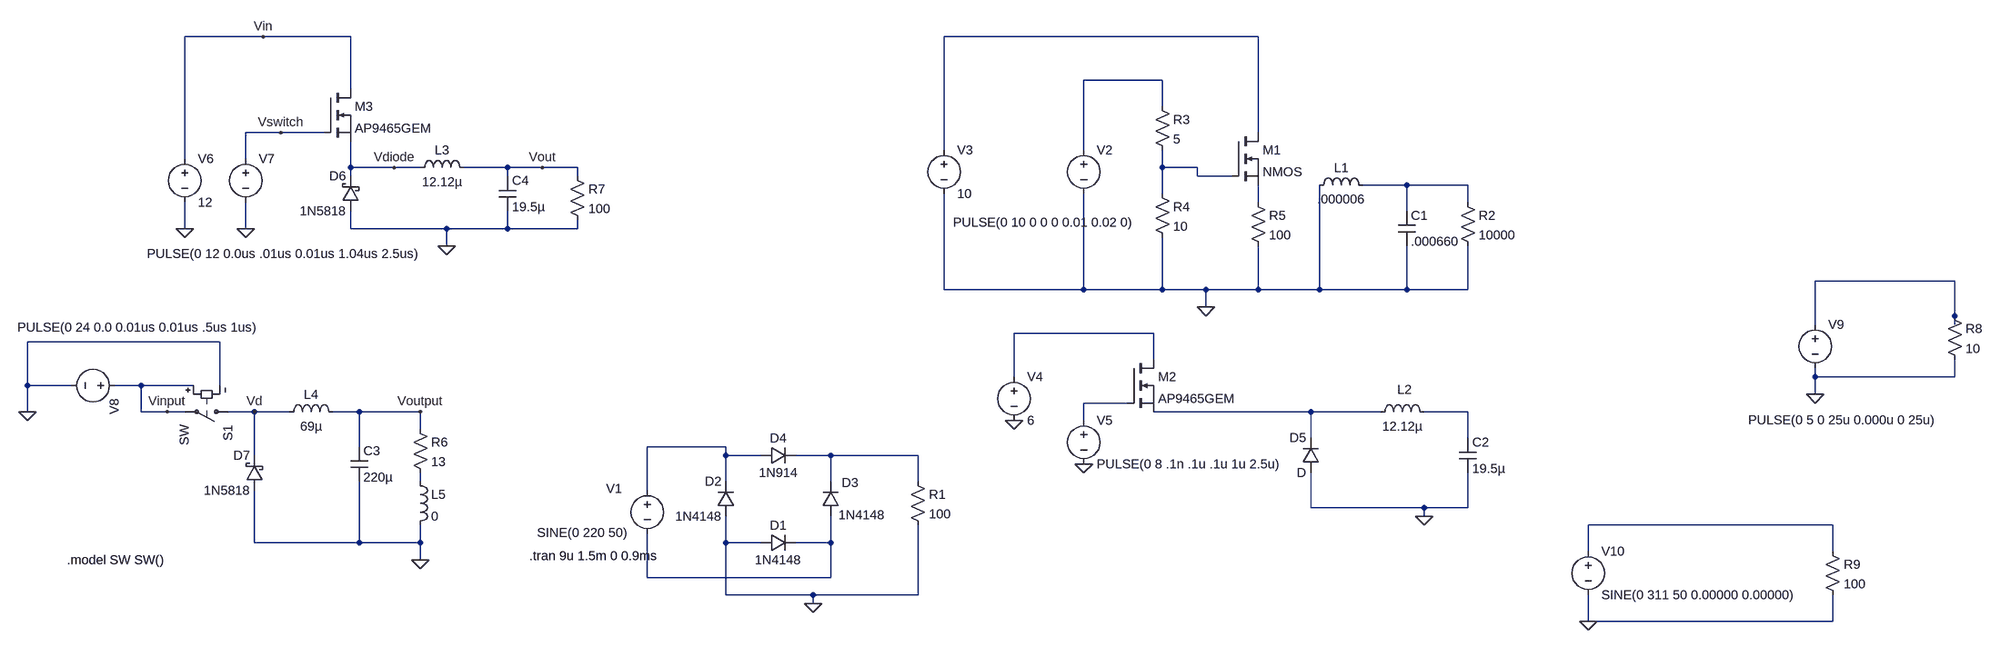
[diagram p0: schematic circuit_ver3.1.asc]
circuit_ver3.1.asc, the LTspice schematic file:
Version 4
SHEET 1 1276 680
WIRE -1952 -720 -2096 -720
WIRE -1792 -720 -1952 -720
WIRE -128 -720 -704 -720
WIRE -304 -640 -448 -640
WIRE -1792 -624 -1792 -720
WIRE -304 -592 -304 -640
WIRE -1920 -544 -1984 -544
WIRE -1840 -544 -1920 -544
WIRE -128 -544 -128 -720
WIRE -704 -512 -704 -720
WIRE -448 -512 -448 -640
WIRE -2096 -496 -2096 -720
WIRE -1984 -496 -1984 -544
WIRE -1792 -480 -1792 -528
WIRE -1712 -480 -1792 -480
WIRE -1664 -480 -1712 -480
WIRE -1504 -480 -1584 -480
WIRE -1440 -480 -1504 -480
WIRE -1376 -480 -1440 -480
WIRE -304 -480 -304 -512
WIRE -240 -480 -304 -480
WIRE -1792 -464 -1792 -480
WIRE -1504 -464 -1504 -480
WIRE -1376 -464 -1376 -480
WIRE -240 -464 -240 -480
WIRE -176 -464 -240 -464
WIRE 144 -448 64 -448
WIRE 256 -448 144 -448
WIRE -304 -432 -304 -480
WIRE -128 -416 -128 -448
WIRE 256 -416 256 -448
WIRE 144 -400 144 -448
WIRE -2096 -368 -2096 -416
WIRE -1984 -368 -1984 -416
WIRE -1792 -368 -1792 -400
WIRE -1616 -368 -1792 -368
WIRE -1504 -368 -1504 -400
WIRE -1504 -368 -1616 -368
WIRE -1376 -368 -1376 -384
WIRE -1376 -368 -1504 -368
WIRE -1616 -336 -1616 -368
WIRE 1152 -272 896 -272
WIRE -704 -256 -704 -432
WIRE -448 -256 -448 -432
WIRE -448 -256 -704 -256
WIRE -304 -256 -304 -352
WIRE -304 -256 -448 -256
WIRE -224 -256 -304 -256
WIRE -128 -256 -128 -336
WIRE -128 -256 -224 -256
WIRE -16 -256 -16 -448
WIRE -16 -256 -128 -256
WIRE 144 -256 144 -336
WIRE 144 -256 -16 -256
WIRE 256 -256 256 -336
WIRE 256 -256 144 -256
WIRE -224 -224 -224 -256
WIRE 1152 -208 1152 -272
WIRE 896 -192 896 -272
WIRE 1152 -192 1152 -208
WIRE -320 -176 -576 -176
WIRE -2032 -160 -2384 -160
WIRE -320 -128 -320 -176
WIRE -576 -96 -576 -176
WIRE 896 -96 896 -112
WIRE 1152 -96 1152 -128
WIRE 1152 -96 896 -96
WIRE -2384 -80 -2384 -160
WIRE -2304 -80 -2384 -80
WIRE -2176 -80 -2224 -80
WIRE -2080 -80 -2176 -80
WIRE -2032 -80 -2032 -160
WIRE 896 -64 896 -96
WIRE -368 -48 -448 -48
WIRE -2384 -32 -2384 -80
WIRE -2176 -32 -2176 -80
WIRE -2128 -32 -2176 -32
WIRE -2096 -32 -2128 -32
WIRE -1968 -32 -2016 -32
WIRE -1904 -32 -1968 -32
WIRE -1776 -32 -1824 -32
WIRE -1664 -32 -1776 -32
WIRE -32 -32 -320 -32
WIRE 96 -32 -32 -32
WIRE 256 -32 176 -32
WIRE -448 -16 -448 -48
WIRE -1664 0 -1664 -32
WIRE -32 16 -32 -32
WIRE 256 16 256 -32
WIRE -1776 32 -1776 -32
WIRE -1104 32 -1248 32
WIRE -1968 48 -1968 -32
WIRE -1104 48 -1104 32
WIRE -1040 48 -1104 48
WIRE -912 48 -976 48
WIRE -752 48 -912 48
WIRE -1664 96 -1664 80
WIRE -1104 96 -1104 48
WIRE -912 96 -912 48
WIRE -752 96 -752 48
WIRE -1248 112 -1248 32
WIRE -32 144 -32 80
WIRE 176 144 -32 144
WIRE 256 144 256 80
WIRE 256 144 176 144
WIRE 176 160 176 144
WIRE 928 176 480 176
WIRE -1968 208 -1968 112
WIRE -1776 208 -1776 96
WIRE -1776 208 -1968 208
WIRE -1664 208 -1664 176
WIRE -1664 208 -1776 208
WIRE -1104 208 -1104 160
WIRE -1040 208 -1104 208
WIRE -912 208 -912 160
WIRE -912 208 -976 208
WIRE 480 224 480 176
WIRE 928 224 928 176
WIRE -1664 240 -1664 208
WIRE -1248 272 -1248 192
WIRE -912 272 -912 208
WIRE -912 272 -1248 272
WIRE -1104 304 -1104 208
WIRE -944 304 -1104 304
WIRE -752 304 -752 176
WIRE -752 304 -944 304
WIRE -944 320 -944 304
WIRE 480 352 480 304
WIRE 928 352 928 304
WIRE 928 352 480 352
FLAG -944 320 0
FLAG -224 -224 0
FLAG 176 160 0
FLAG -576 -16 0
FLAG -448 64 0
FLAG -2096 -368 0
FLAG -1984 -368 0
FLAG -1616 -336 0
FLAG -1440 -480 Vout
FLAG -1952 -720 Vin
FLAG -1920 -544 Vswitch
FLAG -1712 -480 Vdiode
FLAG -2384 -32 0
FLAG -1664 240 0
FLAG -2128 -32 Vinput
FLAG -1664 -32 Voutput
FLAG -1968 -32 Vd
FLAG 896 -64 0
FLAG 480 352 0
SYMBOL voltage -1248 96 R0
WINDOW 3 -202 94 Left 2
WINDOW 123 0 0 Left 2
WINDOW 39 0 0 Left 2
WINDOW 0 -75 13 Left 2
SYMATTR Value SINE(0 220 50)
SYMATTR InstName V1
SYMBOL diode -1040 224 R270
WINDOW 0 32 32 VTop 2
WINDOW 3 0 32 VBottom 2
SYMATTR InstName D1
SYMATTR Value 1N4148
SYMBOL diode -1088 160 R180
WINDOW 0 24 64 Left 2
WINDOW 3 24 0 Left 2
SYMATTR InstName D2
SYMATTR Value 1N4148
SYMBOL diode -896 160 R180
WINDOW 0 -35 62 Left 2
WINDOW 3 -83 3 Left 2
SYMATTR InstName D3
SYMATTR Value 1N4148
SYMBOL diode -1040 64 R270
WINDOW 0 32 32 VTop 2
WINDOW 3 0 32 VBottom 2
SYMATTR InstName D4
SYMATTR Value 1N914
SYMBOL res -768 80 R0
SYMATTR InstName R1
SYMATTR Value 100
SYMBOL voltage -448 -528 R0
WINDOW 3 91 149 Right 2
WINDOW 123 0 0 Left 2
WINDOW 39 0 0 Left 2
SYMATTR Value PULSE(0 10 0 0 0 0.01 0.02 0)
SYMATTR InstName V2
SYMBOL nmos -176 -544 R0
SYMATTR InstName M1
SYMBOL res 240 -432 R0
SYMATTR InstName R2
SYMATTR Value 10000
SYMBOL res -320 -608 R0
SYMATTR InstName R3
SYMATTR Value 5
SYMBOL res -320 -448 R0
SYMATTR InstName R4
SYMATTR Value 10
SYMBOL voltage -704 -528 R0
WINDOW 123 0 0 Left 2
WINDOW 39 0 0 Left 2
SYMATTR InstName V3
SYMATTR Value 10
SYMBOL ind -32 -432 R270
WINDOW 0 32 56 VTop 2
WINDOW 3 5 56 VBottom 2
SYMATTR InstName L1
SYMATTR Value .000006
SYMBOL cap 128 -400 R0
SYMATTR InstName C1
SYMATTR Value .000660
SYMATTR SpiceLine V=50
SYMBOL res -144 -432 R0
SYMATTR InstName R5
SYMATTR Value 100
SYMBOL ind 80 -16 R270
WINDOW 0 41 60 VTop 2
WINDOW 3 5 56 VBottom 2
SYMATTR InstName L2
SYMATTR Value 12.12µ
SYMATTR SpiceLine Rser=0.001
SYMBOL cap 240 16 R0
SYMATTR InstName C2
SYMATTR Value 19.5µ
SYMBOL nmos -368 -128 R0
SYMATTR InstName M2
SYMATTR Value AP9465GEM
SYMBOL voltage -576 -112 R0
WINDOW 123 0 0 Left 2
WINDOW 39 0 0 Left 2
SYMATTR InstName V4
SYMATTR Value 6
SYMBOL voltage -448 -32 R0
WINDOW 123 0 0 Left 2
WINDOW 39 0 0 Left 2
SYMATTR InstName V5
SYMATTR Value PULSE(0 8 .1n .1u .1u 1u 2.5u)
SYMBOL diode -16 80 R180
WINDOW 0 24 64 Left 2
WINDOW 3 24 0 Left 2
SYMATTR InstName D5
SYMBOL nmos -1840 -624 R0
SYMATTR InstName M3
SYMATTR Value AP9465GEM
SYMBOL voltage -2096 -512 R0
WINDOW 123 0 0 Left 2
WINDOW 39 0 0 Left 2
SYMATTR InstName V6
SYMATTR Value 12
SYMBOL voltage -1984 -512 R0
WINDOW 3 -181 190 Left 2
WINDOW 123 0 0 Left 2
WINDOW 39 0 0 Left 2
SYMATTR Value PULSE(0 12 0.0us .01us 0.01us 1.04us 2.5us)
SYMATTR InstName V7
SYMBOL schottky -1776 -400 R180
WINDOW 0 24 64 Left 2
WINDOW 3 24 0 Left 2
SYMATTR InstName D6
SYMATTR Value 1N5818
SYMATTR Description Diode
SYMATTR Type diode
SYMBOL ind -1680 -464 R270
WINDOW 0 32 56 VTop 2
WINDOW 3 5 56 VBottom 2
SYMATTR InstName L3
SYMATTR Value 12.12µ
SYMBOL cap -1520 -464 R0
SYMATTR InstName C4
SYMATTR Value 19.5µ
SYMBOL res -1392 -480 R0
SYMATTR InstName R7
SYMATTR Value 100
SYMBOL sw -2000 -32 R90
SYMATTR InstName S1
SYMATTR SpiceModel SW
SYMBOL voltage -2208 -80 R90
WINDOW 3 -107 -245 VRight 2
WINDOW 123 0 0 Left 2
WINDOW 39 0 0 Left 2
SYMATTR Value PULSE(0 24 0.0 0.01us 0.01us .5us 1us)
SYMATTR InstName V8
SYMBOL res -1680 -16 R0
SYMATTR InstName R6
SYMATTR Value 13
SYMBOL schottky -1952 112 R180
WINDOW 0 24 64 Left 2
WINDOW 3 24 0 Left 2
SYMATTR InstName D7
SYMATTR Value 1N5818
SYMATTR Description Diode
SYMATTR Type diode
SYMBOL cap -1792 32 R0
SYMATTR InstName C3
SYMATTR Value 220µ
SYMBOL ind -1920 -16 R270
WINDOW 0 32 56 VTop 2
WINDOW 3 5 56 VBottom 2
SYMATTR InstName L4
SYMATTR Value 69µ
SYMBOL voltage 896 -208 R0
WINDOW 3 -123 191 Left 2
WINDOW 123 0 0 Left 2
WINDOW 39 0 0 Left 2
SYMATTR Value PULSE(0 5 0 25u 0.000u 0 25u)
SYMATTR InstName V9
SYMBOL res 1136 -224 R0
SYMATTR InstName R8
SYMATTR Value 10
SYMBOL ind -1680 80 R0
SYMATTR InstName L5
SYMATTR Value 0
SYMBOL voltage 480 208 R0
WINDOW 123 0 0 Left 2
WINDOW 39 0 0 Left 2
SYMATTR InstName V10
SYMATTR Value SINE(0 311 50 0.00000 0.00000)
SYMBOL res 912 208 R0
SYMATTR InstName R9
SYMATTR Value 100
TEXT -1464 232 Left 2 !.tran 9u 1.5m 0 0.9ms
TEXT -2312 240 Left 2 !.model SW SW()

The netlist it stands for:
* circuit_ver3.1.asc
V1 N011 N015 SINE(0 220 50)
D1 0 N015 1N4148
D2 0 N011 1N4148
D3 N015 N012 1N4148
D4 N011 N012 1N914
R1 N012 0 100
V2 N002 0 PULSE(0 10 0 0 0 0.01 0.02 0)
M1 N001 N003 N005 N005 NMOS
R2 N004 0 10000
R3 N002 N003 5
R4 N003 0 10
V3 N001 0 10
L1 0 N004 .000006
C1 N004 0 .000660 V=50
R5 N005 0 100
L2 N009 N010 12.12µ Rser=0.001
C2 N010 0 19.5µ
M2 N007 N008 N009 N009 AP9465GEM
V4 N007 0 6
V5 N008 0 PULSE(0 8 .1n .1u .1u 1u 2.5u)
D5 0 N009 D
M3 Vin Vswitch Vdiode Vdiode AP9465GEM
V6 Vin 0 12
V7 Vswitch 0 PULSE(0 12 0.0us .01us 0.01us 1.04us 2.5us)
D6 0 Vdiode 1N5818
L3 Vdiode Vout 12.12µ
C4 Vout 0 19.5µ
R7 Vout 0 100
S1 Vd Vinput Vinput 0 SW SW
V8 Vinput 0 PULSE(0 24 0.0 0.01us 0.01us .5us 1us)
R6 Voutput N013 13
D7 0 Vd 1N5818
C3 Voutput 0 220µ
L4 Vd Voutput 69µ
V9 N006 0 PULSE(0 5 0 25u 0.000u 0 25u)
R8 N006 0 10
L5 N013 0 0
V10 N014 0 SINE(0 311 50 0.00000 0.00000)
R9 N014 0 100
.model D D
.lib standard.dio
.model NMOS NMOS
.model PMOS PMOS
.lib standard.mos
.tran 9u 1.5m 0 0.9ms
.model SW SW()
.backanno
.end